# Altium schematic sheet Ethernet1_Power.SchDoc
size A4; DocumentNumber: 23; SheetNumber: 23; SheetTotal: 47
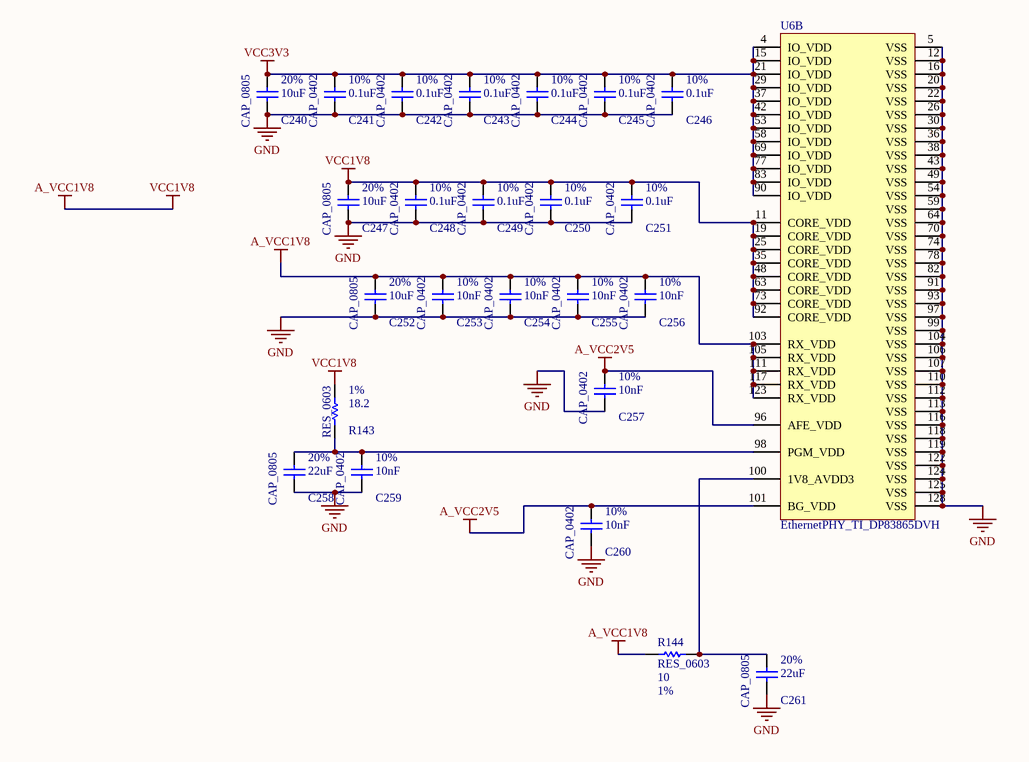
[diagram p0: Ethernet1_Power.SchDoc]

## Parts
C240  CAP_0805  value 10uF  Tolerance: 20%  [CAPC0805(2012)75_N]
C241  CAP_0402  value 0.1uF  Tolerance: 10%  [CAPC0402(1005)60_N]
C242  CAP_0402  value 0.1uF  Tolerance: 10%  [CAPC0402(1005)60_N]
C243  CAP_0402  value 0.1uF  Tolerance: 10%  [CAPC0402(1005)60_N]
C244  CAP_0402  value 0.1uF  Tolerance: 10%  [CAPC0402(1005)60_N]
C245  CAP_0402  value 0.1uF  Tolerance: 10%  [CAPC0402(1005)60_N]
C246  CAP_0402  value 0.1uF  Tolerance: 10%  [CAPC0402(1005)60_N]
C247  CAP_0805  value 10uF  Tolerance: 20%  [CAPC0805(2012)75_N]
C248  CAP_0402  value 0.1uF  Tolerance: 10%  [CAPC0402(1005)60_N]
C249  CAP_0402  value 0.1uF  Tolerance: 10%  [CAPC0402(1005)60_N]
C250  CAP_0402  value 0.1uF  Tolerance: 10%  [CAPC0402(1005)60_N]
C251  CAP_0402  value 0.1uF  Tolerance: 10%  [CAPC0402(1005)60_N]
C252  CAP_0805  value 10uF  Tolerance: 20%  [CAPC0805(2012)75_N]
C253  CAP_0402  value 10nF  Tolerance: 10%  [CAPC0402(1005)60_N]
C254  CAP_0402  value 10nF  Tolerance: 10%  [CAPC0402(1005)60_N]
C255  CAP_0402  value 10nF  Tolerance: 10%  [CAPC0402(1005)60_N]
C256  CAP_0402  value 10nF  Tolerance: 10%  [CAPC0402(1005)60_N]
C257  CAP_0402  value 10nF  Tolerance: 10%  [CAPC0402(1005)60_N]
C258  CAP_0805  value 22uF  Tolerance: 20%  [CAPC0805(2012)75_N]
C259  CAP_0402  value 10nF  Tolerance: 10%  [CAPC0402(1005)60_N]
C260  CAP_0402  value 10nF  Tolerance: 10%  [CAPC0402(1005)60_N]
C261  CAP_0805  value 22uF  Tolerance: 20%  [CAPC0805(2012)75_N]
R143  RES_0603  value 18.2  Tolerance: 1%  [RESC0603(1608)_N]
R144  RES_0603  value 10  Tolerance: 1%  [RESC0603(1608)_N]
U6  EthernetPHY_TI_DP83865DVH  [EthernetPHY_TI_DP83865(PQFP)_VLA128A_N]  (part B of 2)

## Nets
A_VCC1V8: C247.2 C248.2 C249.2 C250.2 C251.2 C252.2 C253.2 C254.2 C255.2 C256.2 R143.2 R144.2 U6.11(CORE_VDD) U6.19(CORE_VDD) U6.25(CORE_VDD) U6.35(CORE_VDD) U6.48(CORE_VDD) U6.63(CORE_VDD) U6.73(CORE_VDD) U6.92(CORE_VDD) U6.103(RX_VDD) U6.105(RX_VDD) U6.111(RX_VDD) U6.117(RX_VDD) U6.123(RX_VDD)  [also labelled VCC1V8]
A_VCC2V5: C257.2 C260.2 U6.96(AFE_VDD) U6.101(BG_VDD)
GND: C240.1 C241.1 C242.1 C243.1 C244.1 C245.1 C246.1 C247.1 C248.1 C249.1 C250.1 C251.1 C252.1 C253.1 C254.1 C255.1 C256.1 C257.1 C258.1 C259.1 C260.1 C261.1 U6.5(VSS) U6.12(VSS) U6.16(VSS) U6.20(VSS) U6.22(VSS) U6.26(VSS) U6.30(VSS) U6.36(VSS) U6.38(VSS) U6.43(VSS) U6.49(VSS) U6.54(VSS) U6.59(VSS) U6.64(VSS) U6.70(VSS) U6.74(VSS) U6.78(VSS) U6.82(VSS) U6.91(VSS) U6.93(VSS) U6.97(VSS) U6.99(VSS) U6.104(VSS) U6.106(VSS) U6.107(VSS) U6.110(VSS) U6.112(VSS) U6.113(VSS) U6.116(VSS) U6.118(VSS) U6.119(VSS) U6.122(VSS) U6.124(VSS) U6.125(VSS) U6.128(VSS)
VCC3V3: C240.2 C241.2 C242.2 C243.2 C244.2 C245.2 C246.2 U6.4(IO_VDD) U6.15(IO_VDD) U6.21(IO_VDD) U6.29(IO_VDD) U6.37(IO_VDD) U6.42(IO_VDD) U6.53(IO_VDD) U6.58(IO_VDD) U6.69(IO_VDD) U6.77(IO_VDD) U6.83(IO_VDD) U6.90(IO_VDD)
NetC258_2: C258.2 C259.2 R143.1 U6.98(PGM_VDD)
NetC261_2: C261.2 R144.1 U6.100(1V8_AVDD3)

## Library data of the parts
C240 C247 C252 = ECJ-2FB0J106M: 10uF, ceramic, 20%, 6.3V, X5R 0805; Manufacturer: Panasonic - ECG; Part Number: ECJ-2FB0J106M; Footprint Ref: CAPC0805(2012)75_N; Library Ref: CAP_0805
C241-C246 C248-C251 = CAP_0402: 0.1uf, ceramic, 10%, 6.3V, X5R, 0402; Part Number: C1005X5R0J104K; Manufacturer: TDK Corporation; Footprint Ref: CAPC0402(1005)60_N; Library Ref: CAP_0402
C253-C257 C259 C260 = CAP_0402: 10000pF, ceramic, 10% 6.3V X5R, 0402; Part Number: GRM155R60J103KA01D; Manufacturer: Murata Electronics North America; Footprint Ref: CAPC0402(1005)60_N; Library Ref: CAP_0402
C258 C261 = JMK212BJ226MG-T: 22uF, ceramic, 20%, 6.3V, X5R, 0805; Manufacturer: Taiyo Yuden; Part Number: JMK212BJ226MG-T; Footprint Ref: CAPC0805(2012)75_N; Library Ref: CAP_0805
R143 = ERJ-3EKF18R2V: RES 18.2 OHM 1/10W 1% 0603 SMD; Manufacturer: Panasonic Electronics Components; Part Number: ERJ-3EKF18R2V; Footprint Ref: RESC0603(1608)_N; Library Ref: RES_0603
R144 = ERJ-3EKF10R0V: RES 10.0 OHM 1/10W 1% 0603 SMD; Manufacturer: Panasonic Electronics Components; Part Number: ERJ-3EKF10R0V; Footprint Ref: RESC0603(1608)_N; Library Ref: RES_0603
U6 = DP83865DVH: Ethernet PHY_TI_DP83865DVH, Gigabit Ethernet PHYTER,128 Lead Plastic Flat Pack; Manufacturer: Texas Instruments; Part Number: DP83865DVH